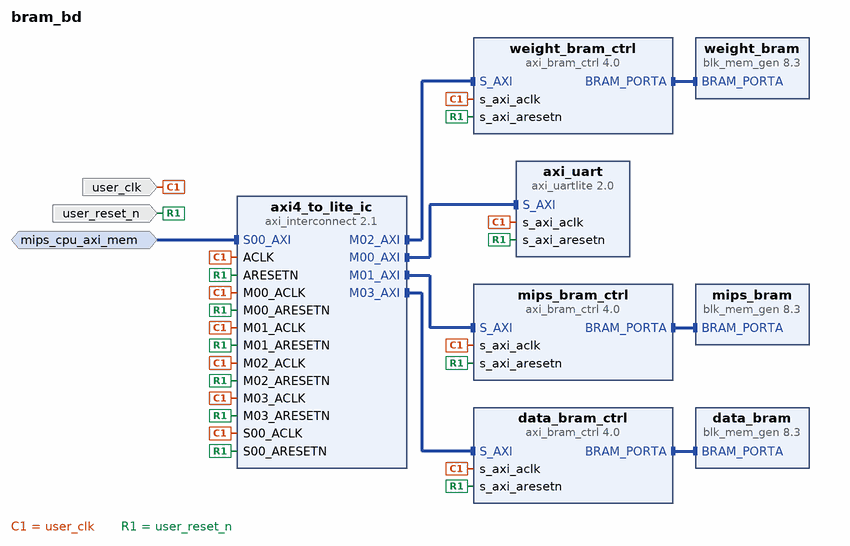
[diagram p0: block diagram of the top level]
# Vivado block design bram_bd, xczu2eg-sfva625-1-e, Vivado 2017.2
create_bd_design bram_bd

create_bd_intf_port -mode Slave -vlnv xilinx.com:interface:aximm_rtl:1.0 mips_cpu_axi_mem
set_property -dict [list \
  CONFIG.DATA_WIDTH 32 \
  CONFIG.PROTOCOL AXI4LITE \
  CONFIG.ID_WIDTH 0 \
  CONFIG.ADDR_WIDTH 32 \
  CONFIG.AWUSER_WIDTH 0 \
  CONFIG.ARUSER_WIDTH 0 \
  CONFIG.WUSER_WIDTH 0 \
  CONFIG.RUSER_WIDTH 0 \
  CONFIG.BUSER_WIDTH 0 \
  CONFIG.READ_WRITE_MODE READ_WRITE \
  CONFIG.HAS_BURST 1 \
  CONFIG.HAS_LOCK 1 \
  CONFIG.HAS_PROT 1 \
  CONFIG.HAS_CACHE 1 \
  CONFIG.HAS_QOS 1 \
  CONFIG.HAS_REGION 1 \
  CONFIG.HAS_WSTRB 1 \
  CONFIG.HAS_BRESP 1 \
  CONFIG.HAS_RRESP 1 \
  CONFIG.SUPPORTS_NARROW_BURST 0 \
  CONFIG.NUM_READ_OUTSTANDING 1 \
  CONFIG.NUM_WRITE_OUTSTANDING 1 \
  CONFIG.MAX_BURST_LENGTH 1 \
  CONFIG.NUM_READ_THREADS 1 \
  CONFIG.NUM_WRITE_THREADS 1 \
  CONFIG.RUSER_BITS_PER_BYTE 0 \
  CONFIG.WUSER_BITS_PER_BYTE 0 \
] [get_bd_intf_ports mips_cpu_axi_mem]
create_bd_port -dir I -type clk user_clk
set_property -dict {CONFIG.ASSOCIATED_BUSIF mips_cpu_axi_mem CONFIG.ASSOCIATED_RESET user_reset_n} [get_bd_ports user_clk]
create_bd_port -dir I -type rst user_reset_n

create_bd_cell -type ip -vlnv xilinx.com:ip:axi_interconnect:2.1 axi4_to_lite_ic
set_property -dict {CONFIG.NUM_SI 1 CONFIG.NUM_MI 4} [get_bd_cells axi4_to_lite_ic]
create_bd_cell -type ip -vlnv xilinx.com:ip:axi_bram_ctrl:4.0 mips_bram_ctrl
set_property -dict {CONFIG.PROTOCOL AXI4LITE CONFIG.SINGLE_PORT_BRAM 1} [get_bd_cells mips_bram_ctrl]
create_bd_cell -type ip -vlnv xilinx.com:ip:axi_bram_ctrl:4.0 weight_bram_ctrl
set_property -dict {CONFIG.PROTOCOL AXI4LITE CONFIG.SINGLE_PORT_BRAM 1} [get_bd_cells weight_bram_ctrl]
create_bd_cell -type ip -vlnv xilinx.com:ip:axi_bram_ctrl:4.0 data_bram_ctrl
set_property -dict {CONFIG.PROTOCOL AXI4LITE CONFIG.SINGLE_PORT_BRAM 1} [get_bd_cells data_bram_ctrl]
create_bd_cell -type ip -vlnv xilinx.com:ip:blk_mem_gen:8.3 mips_bram
set_property -dict [list \
  CONFIG.Enable_32bit_Address true \
  CONFIG.Write_Width_A 32 \
  CONFIG.Write_Depth_A 16384 \
  CONFIG.Read_Width_A 32 \
  CONFIG.Register_PortA_Output_of_Memory_Primitives false \
  CONFIG.Load_Init_File true \
  CONFIG.Coe_File ../../../../../../../../vivado_out/sim/inst.coe \
  CONFIG.Fill_Remaining_Memory_Locations true \
  CONFIG.Use_RSTA_Pin true \
  CONFIG.use_bram_block Stand_Alone \
] [get_bd_cells mips_bram]
create_bd_cell -type ip -vlnv xilinx.com:ip:blk_mem_gen:8.3 weight_bram
set_property -dict [list \
  CONFIG.Enable_32bit_Address true \
  CONFIG.Write_Width_A 32 \
  CONFIG.Write_Depth_A 16384 \
  CONFIG.Read_Width_A 32 \
  CONFIG.Register_PortA_Output_of_Memory_Primitives false \
  CONFIG.Load_Init_File true \
  CONFIG.Coe_File ../../../../../../../../sources/testbench/weight.coe \
  CONFIG.Fill_Remaining_Memory_Locations true \
  CONFIG.Use_RSTA_Pin true \
  CONFIG.use_bram_block Stand_Alone \
] [get_bd_cells weight_bram]
create_bd_cell -type ip -vlnv xilinx.com:ip:blk_mem_gen:8.3 data_bram
set_property -dict [list \
  CONFIG.Enable_32bit_Address true \
  CONFIG.Write_Width_A 32 \
  CONFIG.Write_Depth_A 16384 \
  CONFIG.Read_Width_A 32 \
  CONFIG.Register_PortA_Output_of_Memory_Primitives false \
  CONFIG.Load_Init_File true \
  CONFIG.Coe_File ../../../../../../../../sources/testbench/data.coe \
  CONFIG.Fill_Remaining_Memory_Locations true \
  CONFIG.Use_RSTA_Pin true \
  CONFIG.use_bram_block Stand_Alone \
] [get_bd_cells data_bram]
create_bd_cell -type ip -vlnv xilinx.com:ip:axi_uartlite:2.0 axi_uart
set_property -dict {CONFIG.C_BAUDRATE 115200} [get_bd_cells axi_uart]

# ---- connections ----

connect_bd_intf_net [get_bd_intf_pins axi4_to_lite_ic/M00_AXI] [get_bd_intf_pins axi_uart/S_AXI]
connect_bd_intf_net -intf_net mips_bram_if [get_bd_intf_pins axi4_to_lite_ic/M01_AXI] [get_bd_intf_pins mips_bram_ctrl/S_AXI]
connect_bd_intf_net -intf_net weight_bram_if [get_bd_intf_pins axi4_to_lite_ic/M02_AXI] [get_bd_intf_pins weight_bram_ctrl/S_AXI]
connect_bd_intf_net -intf_net data_bram_if [get_bd_intf_pins axi4_to_lite_ic/M03_AXI] [get_bd_intf_pins data_bram_ctrl/S_AXI]
connect_bd_intf_net [get_bd_intf_pins mips_bram_ctrl/BRAM_PORTA] [get_bd_intf_pins mips_bram/BRAM_PORTA]
connect_bd_intf_net [get_bd_intf_pins weight_bram_ctrl/BRAM_PORTA] [get_bd_intf_pins weight_bram/BRAM_PORTA]
connect_bd_intf_net [get_bd_intf_pins data_bram_ctrl/BRAM_PORTA] [get_bd_intf_pins data_bram/BRAM_PORTA]
connect_bd_intf_net -intf_net mips_cpu_master [get_bd_intf_ports mips_cpu_axi_mem] [get_bd_intf_pins axi4_to_lite_ic/S00_AXI]
connect_bd_net [get_bd_ports user_clk] \
  [get_bd_pins axi4_to_lite_ic/S00_ACLK] [get_bd_pins axi4_to_lite_ic/ACLK] [get_bd_pins axi4_to_lite_ic/M00_ACLK] \
  [get_bd_pins axi4_to_lite_ic/M01_ACLK] [get_bd_pins axi4_to_lite_ic/M02_ACLK] [get_bd_pins axi4_to_lite_ic/M03_ACLK] \
  [get_bd_pins axi_uart/s_axi_aclk] [get_bd_pins mips_bram_ctrl/s_axi_aclk] [get_bd_pins weight_bram_ctrl/s_axi_aclk] \
  [get_bd_pins data_bram_ctrl/s_axi_aclk]
connect_bd_net [get_bd_ports user_reset_n] \
  [get_bd_pins axi4_to_lite_ic/ARESETN] [get_bd_pins axi4_to_lite_ic/S00_ARESETN] [get_bd_pins axi4_to_lite_ic/M00_ARESETN] \
  [get_bd_pins axi4_to_lite_ic/M01_ARESETN] [get_bd_pins axi4_to_lite_ic/M02_ARESETN] \
  [get_bd_pins axi4_to_lite_ic/M03_ARESETN] [get_bd_pins mips_bram_ctrl/s_axi_aresetn] \
  [get_bd_pins weight_bram_ctrl/s_axi_aresetn] [get_bd_pins data_bram_ctrl/s_axi_aresetn] \
  [get_bd_pins axi_uart/s_axi_aresetn]

# ---- address map ----
assign_bd_address -offset 0x00000000 -range 64K -target_address_space [get_bd_addr_spaces mips_cpu_axi_mem] [get_bd_addr_segs mips_bram_ctrl/S_AXI/Mem0]
assign_bd_address -offset 0x00010000 -range 4K -target_address_space [get_bd_addr_spaces mips_cpu_axi_mem] [get_bd_addr_segs axi_uart/S_AXI/Reg]
assign_bd_address -offset 0x08000000 -range 64K -target_address_space [get_bd_addr_spaces mips_cpu_axi_mem] [get_bd_addr_segs weight_bram_ctrl/S_AXI/Mem0]
assign_bd_address -offset 0x08100000 -range 64K -target_address_space [get_bd_addr_spaces mips_cpu_axi_mem] [get_bd_addr_segs data_bram_ctrl/S_AXI/Mem0]

validate_bd_design
save_bd_design
